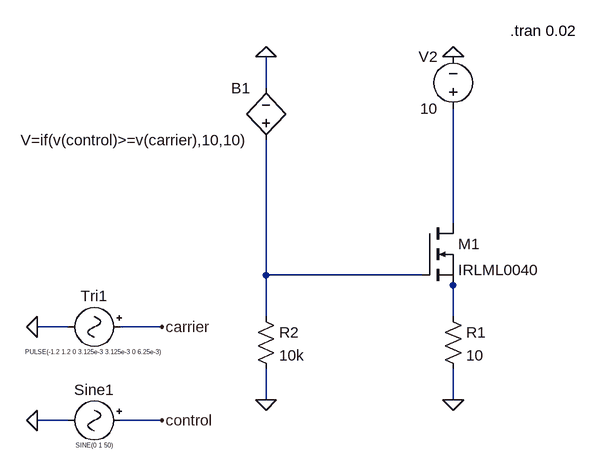
[diagram p0: schematic CleanMOSFET.asc]
CleanMOSFET.asc, the LTspice schematic file:
Version 4
SHEET 1 880 680
WIRE 224 48 224 0
WIRE 512 256 512 80
WIRE 224 336 224 128
WIRE 464 336 224 336
WIRE 512 352 512 304
WIRE 224 400 224 336
WIRE 512 400 512 352
WIRE -80 416 -128 416
WIRE 64 416 0 416
WIRE 224 528 224 480
WIRE 512 528 512 480
WIRE -80 560 -128 560
WIRE 64 560 0 560
FLAG 512 528 0
FLAG 512 0 0
FLAG -128 416 0
FLAG -128 560 0
FLAG 64 416 carrier
FLAG 64 560 control
FLAG 224 0 0
FLAG 224 528 0
SYMBOL nmos 464 256 R0
SYMATTR InstName M1
SYMATTR Value IRLML0040
SYMBOL Voltage 512 96 R180
WINDOW 0 24 96 Left 2
WINDOW 3 24 16 Left 2
SYMATTR InstName V2
SYMATTR Value 10
SYMATTR SpiceLine Rser=0.0
SYMBOL signal 16 416 R90
WINDOW 0 -32 56 VBottom 2
WINDOW 3 32 56 VTop 0
SYMATTR InstName Tri1
SYMATTR Value PULSE(-1.2 1.2 0 3.125e-3 3.125e-3 0 6.25e-3)
SYMBOL signal 16 560 R90
WINDOW 0 -32 56 VBottom 2
WINDOW 3 32 56 VTop 0
SYMATTR InstName Sine1
SYMATTR Value SINE(0 1 50)
SYMBOL bv 224 144 R180
WINDOW 3 24 16 Left 2
WINDOW 0 24 96 Left 2
SYMATTR Value V=if(v(control)>=v(carrier),10,10)
SYMATTR InstName B1
SYMBOL Res 208 384 R0
SYMATTR InstName R2
SYMATTR Value 10k
SYMBOL Res 496 384 R0
SYMATTR InstName R1
SYMATTR Value 10
TEXT 600 -40 Left 2 !.tran 0.02

The netlist it stands for:
* CleanMOSFET.asc
M1 N001 N002 N003 N003 IRLML0040
V2 N001 0 10 Rser=0.0
V§Tri1 carrier 0 PULSE(-1.2 1.2 0 3.125e-3 3.125e-3 0 6.25e-3)
V§Sine1 control 0 SINE(0 1 50)
B1 N002 0 V=if(v(control)>=v(carrier),10,10)
R2 N002 0 10k
R1 N003 0 10
.model NMOS NMOS
.model PMOS PMOS
.lib standard.mos
.tran 0.02
.backanno
.end